# Altium schematic sheet Controler.SchDoc: Microcontroller STM32F101
size 111 x 101 mm
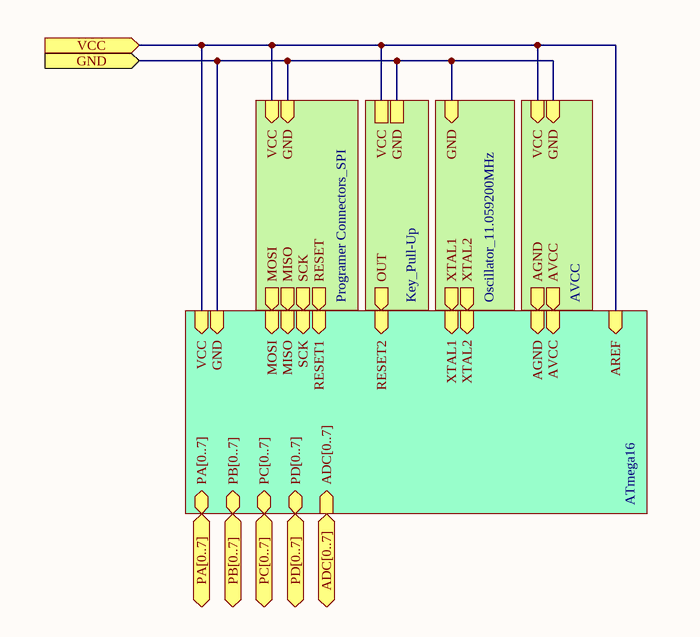
[diagram p0: Controler.SchDoc]

## Sub-sheets
ATmega16 = MCU_ATmega16_DIP.SchDoc: XTAL1 (in), XTAL2 (in), MOSI (in), MISO (in), SCK (in), RESET1 (in), PA[0..7] (bidir), VCC (in), GND (in), PB[0..7], PC[0..7] (bidir), PD[0..7], RESET2 (in), AVCC (in), AREF (in), AGND (in), ADC[0..7] (in)
U_AVCC = AVCC: VCC (in), GND (in), AVCC (out), AGND (out)
U_Key = Key_Pull-Up: OUT (out), GND, VCC
U_Oscillator_11 = Oscillator_11.059200MHz: XTAL1 (out), XTAL2 (out), GND (in)
U_Programer Connectors_SPI = Programer Connectors_SPI: RESET (out), MOSI (out), MISO (out), SCK (out), GND (in), VCC (in)

## Ports
ADC[0..7] (in), GND (in), PA[0..7] (bidir), PB[0..7] (bidir), PC[0..7] (bidir), PD[0..7] (bidir), VCC (in)

## Nets
GND: port GND, sheet ATmega16/GND, sheet U_Key/GND, sheet U_Oscillator_11/GND, sheet U_AVCC/GND, sheet U_Programer Connectors_SPI/GND
VCC: port VCC, sheet ATmega16/VCC, sheet ATmega16/AREF, sheet U_Key/VCC, sheet U_AVCC/VCC, sheet U_Programer Connectors_SPI/VCC
(unnamed): sheet ATmega16/XTAL1, sheet U_Oscillator_11/XTAL1
(unnamed): sheet ATmega16/XTAL2, sheet U_Oscillator_11/XTAL2
(unnamed): sheet ATmega16/MOSI, sheet U_Programer Connectors_SPI/MOSI
(unnamed): sheet ATmega16/MISO, sheet U_Programer Connectors_SPI/MISO
(unnamed): sheet ATmega16/SCK, sheet U_Programer Connectors_SPI/SCK
(unnamed): sheet ATmega16/RESET1, sheet U_Programer Connectors_SPI/RESET
(unnamed): sheet ATmega16/RESET2, sheet U_Key/OUT
(unnamed): sheet ATmega16/AVCC, sheet U_AVCC/AVCC
(unnamed): sheet ATmega16/AGND, sheet U_AVCC/AGND

## Buses and harness runs
bus port ADC[0..7] = sheet ATmega16/ADC[0..7]
bus port PA[0..7] = sheet ATmega16/PA[0..7]
bus port PB[0..7] = sheet ATmega16/PB[0..7]
bus port PC[0..7] = sheet ATmega16/PC[0..7]
bus port PD[0..7] = sheet ATmega16/PD[0..7]

## Notes on the sheet
- Sheet Title
- Project Title
- Size:
- Date:
- A4
- Item:
- Time:
- Revision:
- Sheet
- of
- File: